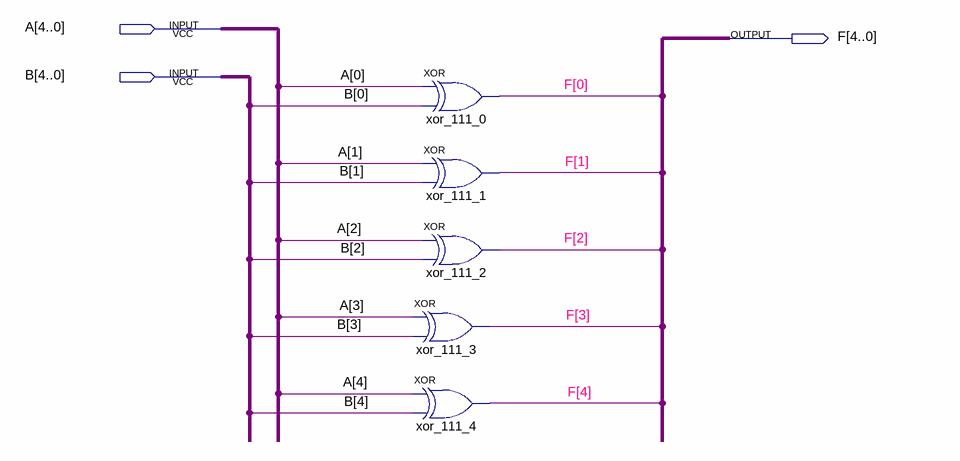
[diagram p0: schematic sheet]
// Quartus schematic XOR_111.bdf as structural Verilog: 5 symbols, 3 pins
module XOR_111 (
  input  [4:0] A,
  input  [4:0] B,
  output [4:0] F
);

  xor xor_111_0 (F[0], A[0], B[0]);
  xor xor_111_1 (F[1], A[1], B[1]);
  xor xor_111_2 (F[2], A[2], B[2]);
  xor xor_111_3 (F[3], A[3], B[3]);
  xor xor_111_4 (F[4], A[4], B[4]);
endmodule
